# EAGLE design co2 (EAGLE 7.6.0)
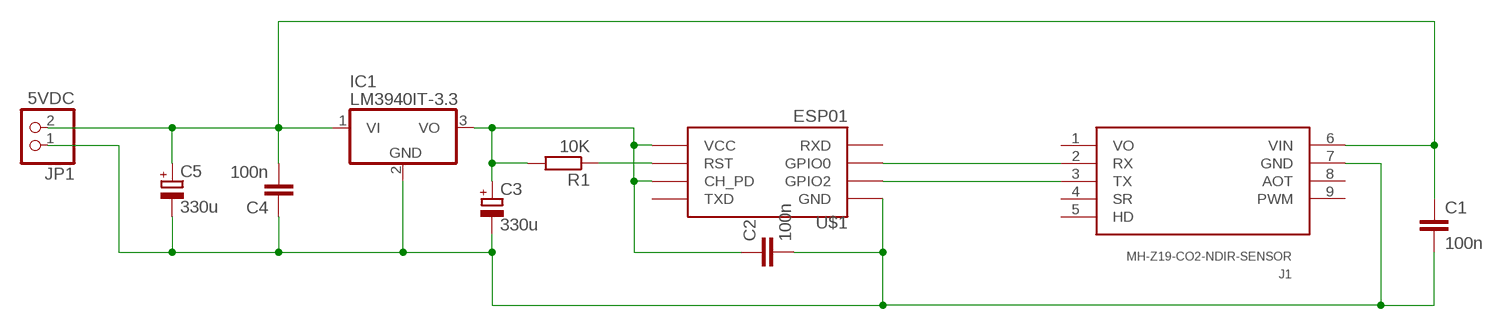
[diagram p0: schematic, sheet 1]

## Parts
C1  100n  C-EU050-025X075  [C050-025X075]
C2  100n  C-EU050-025X075  [C050-025X075]
C3  330u  CPOL-EUE2.5-6  [E2,5-6]
C4  100n  C-EU050-025X075  [C050-025X075]
C5  330u  CPOL-EUE2.5-6  [E2,5-6]
IC1  LM3940IT-3.3  7805T  [TO220H]
J1  MH-Z19-CO2-NDIR-SENSOR  [MH-Z19]
JP1  5VDC  PINHD-1X2  [1X02]
R1  10K  R-EU_0204/7  [0204/7]
U$1  ESP01  [ESP01]

## Nets
+3.3V: C2.1 C3.+ IC1.3(VO) R1.2 U$1.CH_PD U$1.VCC
+5V: C1.1 C4.2 C5.+ IC1.1(VI) J1.6(VIN) JP1.2
GND: C1.2 C2.2 C3.- C4.1 C5.- IC1.2(GND) J1.7(GND) JP1.1 U$1.GND
N$1: J1.2(RX) U$1.GPIO0
N$2: J1.3(TX) U$1.GPIO2
N$4: R1.1 U$1.RST
Unconnected: J1.4(SR) J1.5(HD) J1.8(AOT) J1.9(PWM) U$1.RX(RXD) U$1.TX(TXD)

## Power pins joined to a net without a drawn wire
VO: J1.1(VO)

## Library data of the parts
C1 C2 C4 = rcl:C-EU: CAPACITOR, European symbol
C3 C5 = rcl:CPOL-EU: POLARIZED CAPACITOR, European symbol
IC1 = adafruit:78*: Positive VOLTAGE REGULATOR Added bigger pads to the TO-92 package
J1 = mh-z19:MH-Z19: MH-Z19 - CO2 NDIR SENSOR
JP1 = pinhead:PINHD-1X2: PIN HEADER
R1 = rcl:R-EU_: RESISTOR, European symbol
U$1 = esp8266modules:ESP01: ESP8266 Wifi module 01

## Board
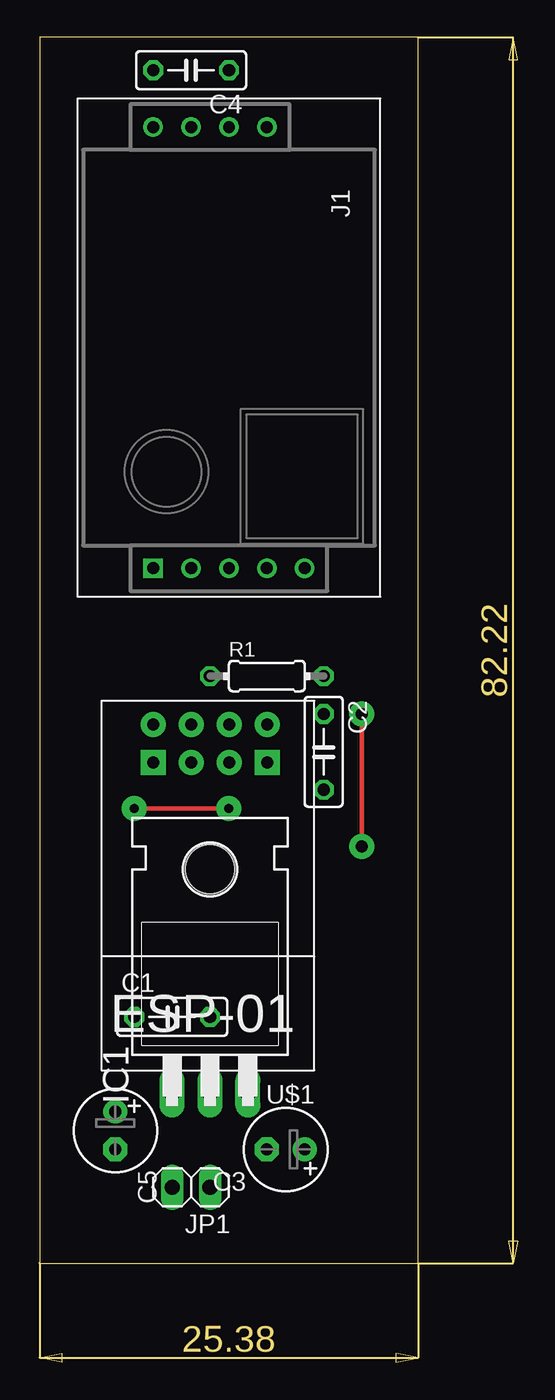
[diagram p1: board, top side]
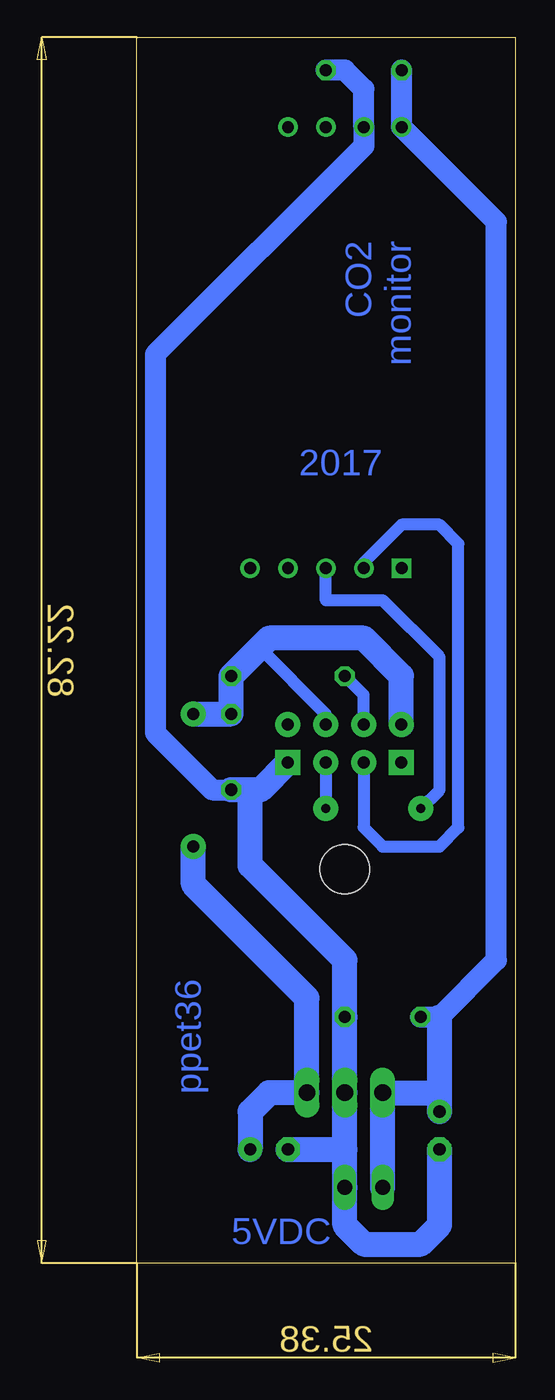
[diagram p2: board, bottom side, seen from below]

Size 25.38 x 82.22 mm. Coordinates in mm from the lower left corner, seen from the top.
Outline: 0,0 25.38,0 25.38,82.22 0,82.22 0,0
Copper layers (1*16): Top 0.035mm / dielectric 1.5mm / Bottom 0.035mm
Design rules "default": minimum track width 10mil, minimum drill 24mil, track to track 8mil, track to pad 8mil, pad to pad 8mil, via to via 8mil, smd to smd 8mil, copper to edge 40mil, drill to drill 8mil, minimum pad ring 10mil, minimum via ring 8mil, stop-mask expansion 4mil, vias tented up to drill 0mil, thermal gap 10mil

### Footprints (pad centres in the part's own frame; a part is rotated, then mirrored left to right if it is on the bottom)
C050-025X075 = drill 0.813 octagon: 1 -2.54,0; 2 2.54,0
E2,5-6 = drill 0.813 pad 1.6: + -1.27,0 | drill 0.813 pad 1.6 octagon: - 1.27,0
TO220H = drill 1.118 long: 1 -2.54,-10.16; 2 0,-10.16; 3 2.54,-10.16 | hole 3.302: 0,4.826
MH-Z19 = drill 0.8 square: 1 29.591,0 | drill 0.8: 2 29.591,2.54; 3 29.591,5.08; 4 29.591,7.62; 5 29.591,10.16; 6 0,0; 7 0,2.54; 8 0,5.08; 9 0,7.62
1X02 = drill 1.016 long: 1 -1.27,0; 2 1.27,0
0204/7 = drill 0.813 octagon: 1 -3.81,0; 2 3.81,0
ESP01 = drill 0.8 pad 1.676: CH_PD -1.285,-8.178; GPIO0 1.255,-5.638; GPIO2 -1.285,-5.638; RST 1.255,-8.178; TX -3.825,-8.178; VCC 3.795,-8.178 | drill 0.8 pad 1.676 square: GND -3.825,-5.638; RX 3.795,-5.638

### Placement (x,y rotation side)
C1  8.89,16.51 0 top
C2  19.05,34.29 270 top
C3  16.51,7.62 180 top
C4  10.16,80.01 180 top
C5  5.08,8.89 270 top
IC1  11.43,21.59 0 top
J1  7.62,76.2 270 top
JP1  10.16,5.08 180 top
R1  15.24,39.37 0 top
U$1  11.43,27.94 180 top

### Tracks (layer width: path | path; a pad name or v marks a point on that pad's centre or on a via)
+3.3V  (via drill 0.8 pad 1.68)
  Top 0.305: v21.59,27.94 v21.59,36.83
  Bottom 0.813: U$1.CH_PD 12.71,36.84 17.14,41.27
  Bottom 1.676: C3.+ 17.78,10.16 16.51,11.43 IC1.3 13.97,17.78 21.59,25.4 v21.59,27.94 | U$1.VCC 7.63,39.38 10.16,41.91 16.51,41.91 17.14,41.27 R1.2 C2.1 v21.59,36.83
+5V
  Bottom 1.422: C1.1 5.08,16.51 1.27,20.32 1.27,69.85 J1.6 C4.2
  Bottom 1.676: JP1.2 IC1.1 5.08,11.43 | C5.+ 5.08,11.43 | 5.08,11.43 5.08,16.51
GND
  Bottom 1.422: C2.2 20.32,31.75 24.13,35.56 24.13,60.96 10.16,74.93 J1.7 10.16,78.74 11.43,80.01 C4.1
  Bottom 1.676: U$1.GND 17.08,31.75 17.78,31.75 | 17.78,31.75 C2.2 | 17.78,31.75 17.78,26.67 11.43,20.32 C1.2 IC1.2 11.43,7.62 | 11.43,7.62 JP1.1 11.43,2.54 10.16,1.27 6.35,1.27 5.08,2.54 C5.- | C3.- 11.43,7.62
N$1
  Bottom 0.813: U$1.GPIO0 10.17,29.22 8.89,27.94 5.08,27.94 3.81,29.21 3.81,48.26 5.08,49.53 7.62,49.53 10.16,46.99 J1.2
N$2  (via drill 0.6 pad 1.68)
  Top 0.305: v12.7,30.48 v6.35,30.48
  Bottom 0.813: U$1.GPIO2 12.71,30.49 v12.7,30.48 | v6.35,30.48 5.08,31.75 5.08,40.64 8.89,44.45 12.7,44.45 J1.3
N$4
  Bottom 0.813: U$1.RST 10.17,38.12 R1.1

### Text on the board
Bottom: CO2 / monitor | 2017 | ppet36 | 5VDC